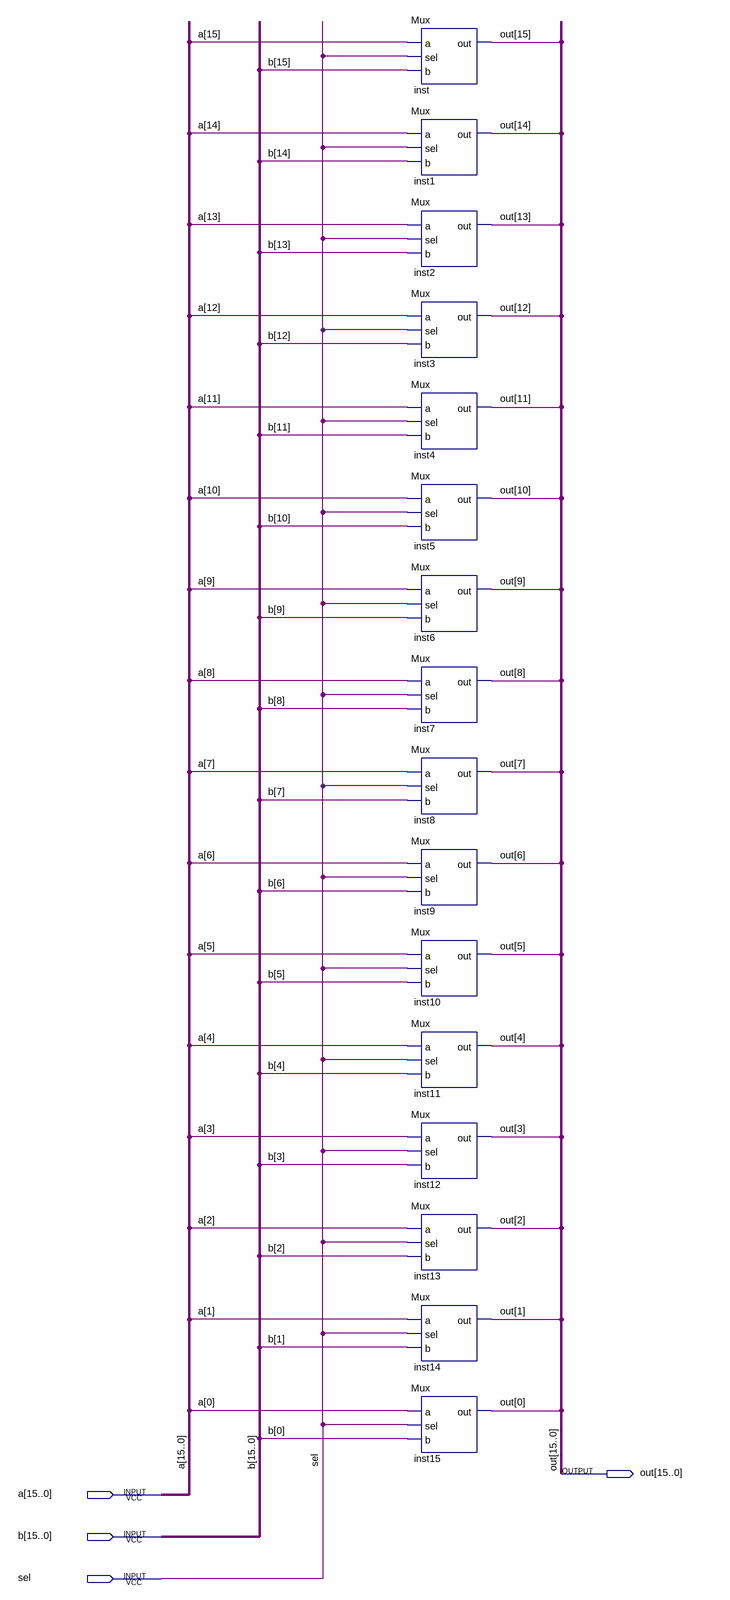
[diagram p0: schematic sheet]
// Quartus schematic Mux16.bdf as structural Verilog: 16 symbols, 4 pins
module Mux16 (
  input  [15:0] a,
  input  [15:0] b,
  input  sel,
  output [15:0] out
);

  Mux inst (.a(a[15]), .sel(sel), .b(b[15]), .out(out[15]));
  Mux inst1 (.a(a[14]), .sel(sel), .b(b[14]), .out(out[14]));
  Mux inst2 (.a(a[13]), .sel(sel), .b(b[13]), .out(out[13]));
  Mux inst3 (.a(a[12]), .sel(sel), .b(b[12]), .out(out[12]));
  Mux inst4 (.a(a[11]), .sel(sel), .b(b[11]), .out(out[11]));
  Mux inst5 (.a(a[10]), .sel(sel), .b(b[10]), .out(out[10]));
  Mux inst6 (.a(a[9]), .sel(sel), .b(b[9]), .out(out[9]));
  Mux inst7 (.a(a[8]), .sel(sel), .b(b[8]), .out(out[8]));
  Mux inst8 (.a(a[7]), .sel(sel), .b(b[7]), .out(out[7]));
  Mux inst9 (.a(a[6]), .sel(sel), .b(b[6]), .out(out[6]));
  Mux inst10 (.a(a[5]), .sel(sel), .b(b[5]), .out(out[5]));
  Mux inst11 (.a(a[4]), .sel(sel), .b(b[4]), .out(out[4]));
  Mux inst12 (.a(a[3]), .sel(sel), .b(b[3]), .out(out[3]));
  Mux inst13 (.a(a[2]), .sel(sel), .b(b[2]), .out(out[2]));
  Mux inst14 (.a(a[1]), .sel(sel), .b(b[1]), .out(out[1]));
  Mux inst15 (.a(a[0]), .sel(sel), .b(b[0]), .out(out[0]));
endmodule
